# Altium schematic sheet E17-04-HV_MEASURE.SchDoc
size A; DocumentNumber: 6; SheetNumber: 6; SheetTotal: 17
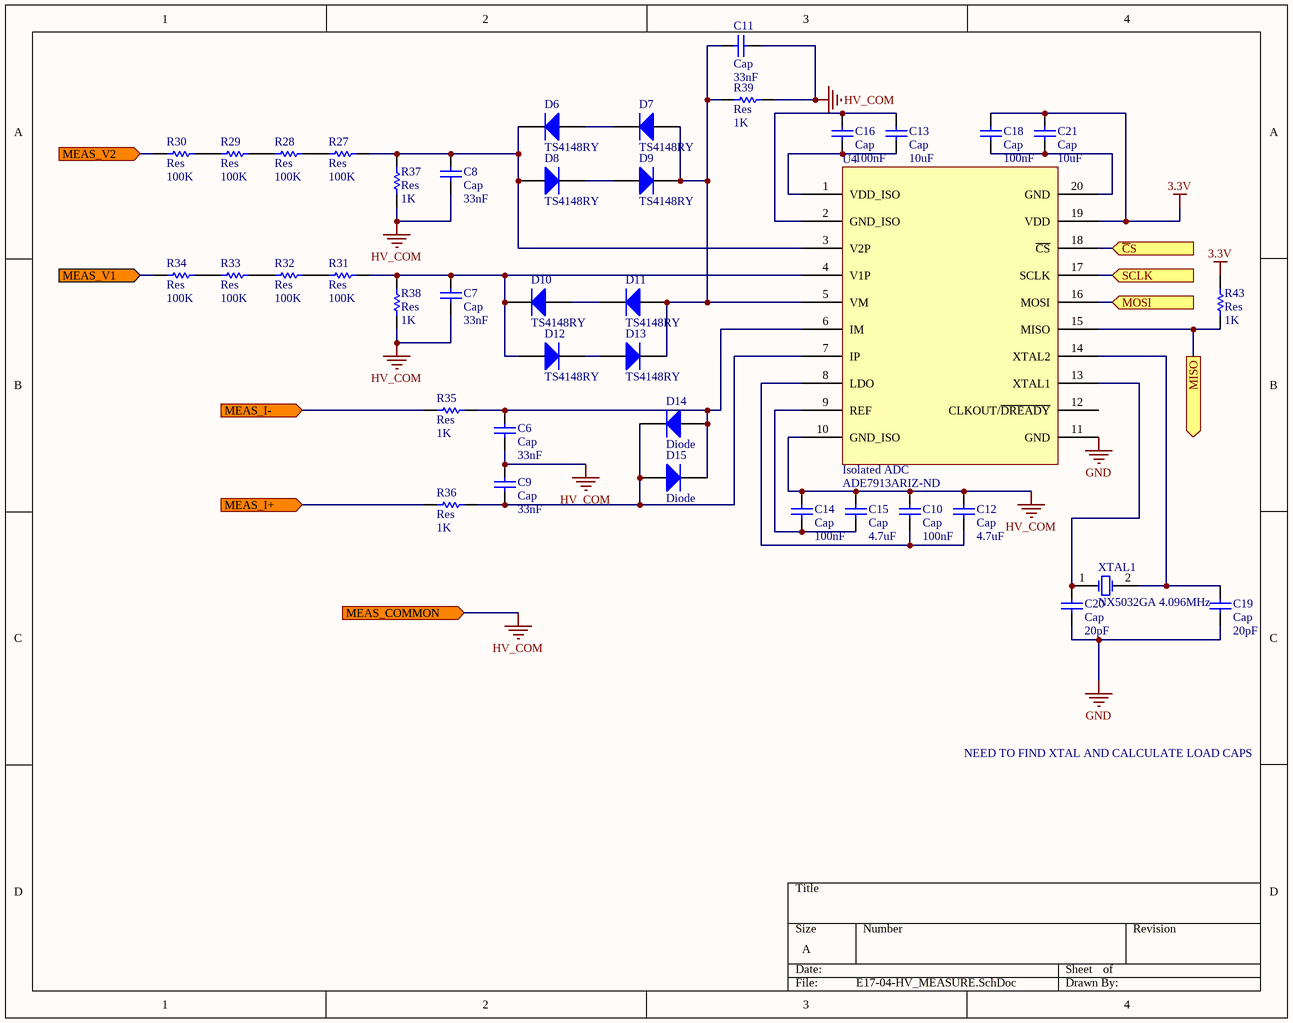
[diagram p0: E17-04-HV_MEASURE.SchDoc]

## Parts
C6  Cap  value 33nF  [C0805]
C7  Cap  value 33nF  [C0805]
C8  Cap  value 33nF  [C0805]
C9  Cap  value 33nF  [C0805]
C10  Cap  value 100nF  [C0805]
C11  Cap  value 33nF  [C0805]
C12  Cap  value 4.7uF  [C0805]
C13  Cap  value 10uF  [C0805]
C14  Cap  value 100nF  [C0805]
C15  Cap  value 4.7uF  [C0805]
C16  Cap  value 100nF  [C0805]
C18  Cap  value 100nF  [C0805]
C19  Cap  value 20pF  [C0805]
C20  Cap  value 20pF  [C0805]
C21  Cap  value 10uF  [C0805]
D6  TS4148RY  [DIOC2012X09N]
D7  TS4148RY  [DIOC2012X09N]
D8  TS4148RY  [DIOC2012X09N]
D9  TS4148RY  [DIOC2012X09N]
D10  TS4148RY  [DIOC2012X09N]
D11  TS4148RY  [DIOC2012X09N]
D12  TS4148RY  [DIOC2012X09N]
D13  TS4148RY  [DIOC2012X09N]
D14  Diode  [SMC]
D15  Diode  [SMC]
R27  Res  value 100K  [3216[1206]]
R28  Res  value 100K  [3216[1206]]
R29  Res  value 100K  [3216[1206]]
R30  Res  value 100K  [3216[1206]]
R31  Res  value 100K  [3216[1206]]
R32  Res  value 100K  [3216[1206]]
R33  Res  value 100K  [3216[1206]]
R34  Res  value 100K  [3216[1206]]
R35  Res  value 1K  [2012[0805]]
R36  Res  value 1K  [2012[0805]]
R37  Res  value 1K  [2012[0805]]
R38  Res  value 1K  [2012[0805]]
R39  Res  value 1K  [2012[0805]]
R43  Res  value 1K  [2012[0805]]
U4  Isolated ADC  Supplier Part Number 1: ADE7913ARIZ-ND  [SOIC127P1030X265-20N]
XTAL1  NX5032GA 4.096MHz  [NX5032GA]

## Ports
MEAS_COMMON (in), MEAS_I+ (in), MEAS_I- (in), MEAS_V1 (in), MEAS_V2 (in), MISO (out), MOSI (in), SCLK (in), ~{C}S (in)

## Nets
3.3V: C18.1 C21.1 R43.1 U4.19(VDD)
GND: C19.1 C20.1 U4.11(GND)
HV_COM: C6.1 C7.1 C8.1 C9.2 C10.1 C11.1 C12.1 C14.1 C15.1 R37.1 R38.1 R39.1 U4.10(GND_ISO) ; port MEAS_COMMON
~{C}S: U4.18(~{CS}) ; port ~{C}S
MEAS_I+: R36.2 ; port MEAS_I+
MEAS_I-: R35.2 ; port MEAS_I-
MEAS_V1: R34.1 ; port MEAS_V1
MEAS_V2: R30.1 ; port MEAS_V2
MISO: R43.2 U4.15(MISO) ; port MISO
MOSI: U4.16(MOSI) ; port MOSI
SCLK: U4.17(SCLK) ; port SCLK
NetC6_2: C6.2 D14.1(A) D15.2(K) R35.1 U4.6(IM)
NetC7_2: C7.2 D10.2(K) D12.1(A) R31.2 R38.2 U4.4(V1P)
NetC8_2: C8.2 D6.2(K) D8.1(A) R27.2 R37.2 U4.3(V2P)
NetC9_1: C9.1 D14.2(K) D15.1(A) R36.1 U4.7(IP)
NetC10_2: C10.2 C12.2 U4.8(LDO)
NetC11_2: C11.2 D7.1(A) D9.2(K) D11.1(A) D13.2(K) R39.2 U4.5(VM)
NetC13_1: C13.1 C16.1 U4.2(GND_ISO)
NetC13_2: C13.2 C16.2 U4.1(VDD_ISO)
NetC14_2: C14.2 C15.2 U4.9(REF)
NetC18_2: C18.2 C21.2 U4.20(GND)
NetC19_2: C19.2 U4.14(XTAL2) XTAL1.2(OSC2)
NetC20_2: C20.2 U4.13(XTAL1) XTAL1.1(OSC1)
NetD6_2: D6.2(K) D7.2(K)
NetD8_1: D8.1(A) D9.1(A)
NetD10_2: D10.2(K) D11.2(K)
NetD12_2: D12.2(K) D13.1(A)
NetR27_1: R27.1 R28.2
NetR28_1: R28.1 R29.2
NetR29_1: R29.1 R30.2
NetR31_1: R31.1 R32.2
NetR32_1: R32.1 R33.2
NetR33_1: R33.1 R34.2

Not connected (* = marked no-connect by the designer): U4 12(CLKOUT/~{DREADY})

## Notes on the sheet
- NEED TO FIND XTAL AND CALCULATE LOAD CAPS

## Library data of the parts
C6-C16 C18-C21 = Cap: Capacitor; Published: 8-Jun-2000; LatestRevisionDate: 17-Jul-2002; LatestRevisionNote: Re-released for DXP Platform.; PackageReference: C1206; Publisher: Altium Limited
D6-D15 = Diode: Default Diode; Published: 8-Jun-2000; LatestRevisionDate: 17-Jul-2002; LatestRevisionNote: Re-released for DXP Platform.; PackageVersion: Sep-1996; PackageReference: SMC; Publisher: Altium Limited; PackageDescription: DO-214-AB/SMC; 2 C-Bend Leads; Body 7.9 x 5.9 mm, inc. leads (LxW); Code_JEDEC: DO-214-AB
R27-R39 R43 = Res: Surface Mount Resistor; Published: 8-Jun-2000; LatestRevisionDate: 17-Jul-2002; LatestRevisionNote: Re-released for DXP Platform.; PackageReference: AXIAL-0.5; Publisher: Altium Limited
U4 = ADE7913: 3-Channel, Isolated, Sigma Delta ADC with SPI; Supplier 1: Digi-Key
XTAL1 = NX5032GA